# EAGLE design CAN_controller_main_dash (EAGLE 9.6.2)
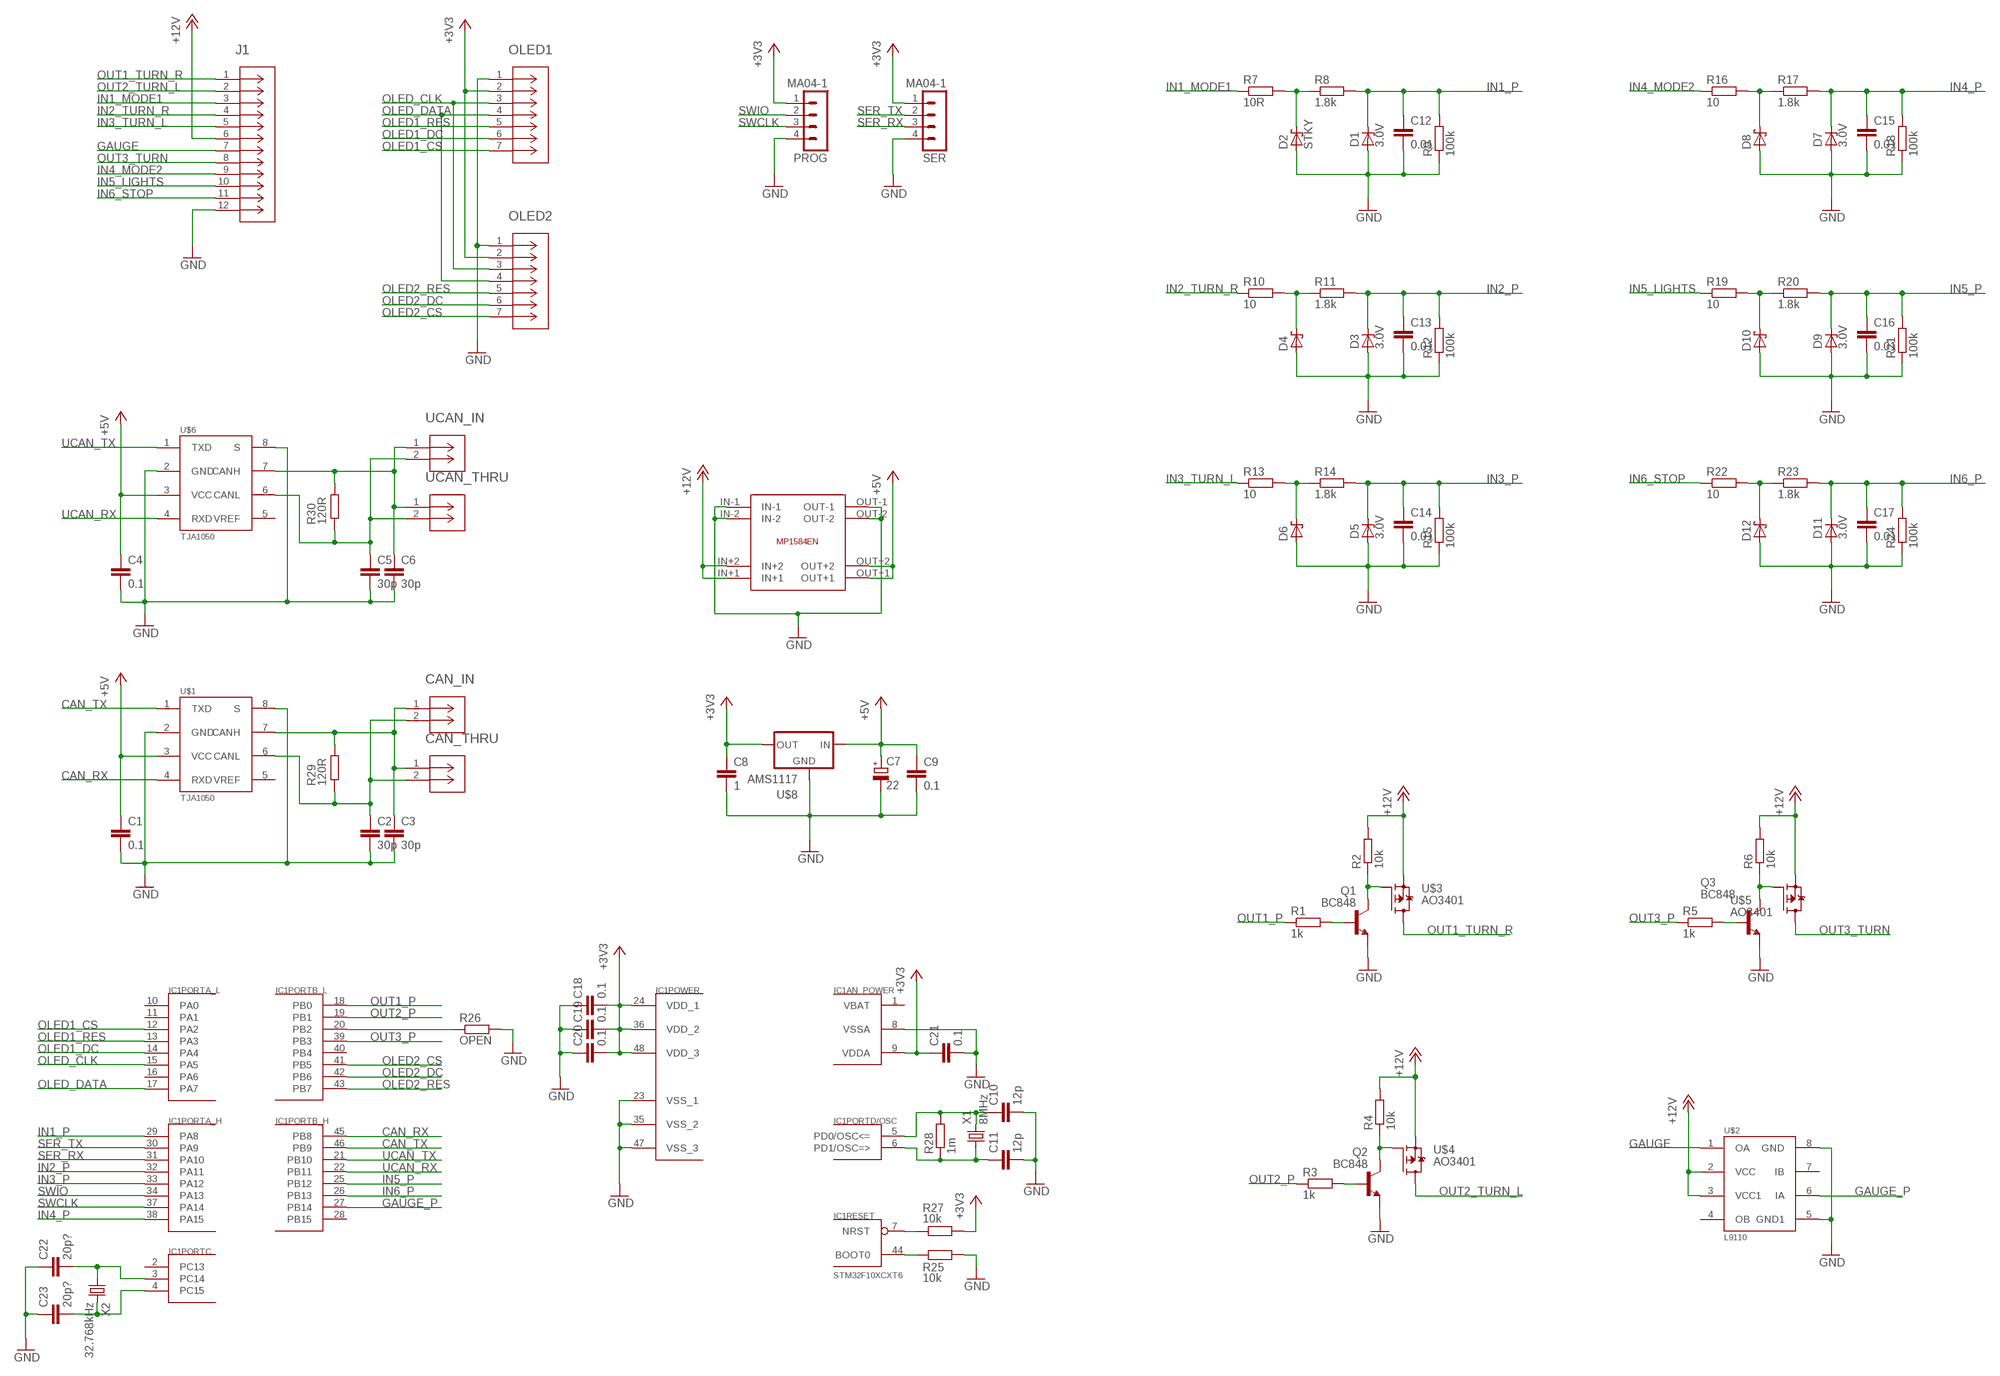
[diagram p0: schematic, sheet 1]

## Parts
C1  0.1  C-EUC0603  [C0603]
C2  30p  C-EUC0603  [C0603]
C3  30p  C-EUC0603  [C0603]
C4  0.1  C-EUC0603  [C0603]
C5  30p  C-EUC0603  [C0603]
C6  30p  C-EUC0603  [C0603]
C7  22  CPOL-EUA/3216-18R  [A/3216-18R]
C8  1  C-EUC0805  [C0805]
C9  0.1  C-EUC0603  [C0603]
C10  12p  C-EUC0603  [C0603]
C11  12p  C-EUC0603  [C0603]
C12  0.01  C-EUC0603  [C0603]
C13  0.01  C-EUC0603  [C0603]
C14  0.01  C-EUC0603  [C0603]
C15  0.01  C-EUC0603  [C0603]
C16  0.01  C-EUC0603  [C0603]
C17  0.01  C-EUC0603  [C0603]
C18  0.1  C-EUC0603  [C0603]
C19  0.1  C-EUC0603  [C0603]
C20  0.1  C-EUC0603  [C0603]
C21  0.1  C-EUC0603  [C0603]
C22  20p?  C-EUC0603  [C0603]
C23  20p?  C-EUC0603  [C0603]
CAN_IN  CAN_IN  MOLEX_2068320202  [CON_2068320202_MOL]
CAN_THRU  MOLEX_2068320202  [CON_2068320202_MOL]
D1  3.0V  DIODE_ZENER0603  [ZD0603]
D2  STKY  DIODE_SCHOTTKY  [ZD0603]
D3  3.0V  DIODE_ZENER0603  [ZD0603]
D4  DIODE_SCHOTTKY  [ZD0603]
D5  3.0V  DIODE_ZENER0603  [ZD0603]
D6  DIODE_SCHOTTKY  [ZD0603]
D7  3.0V  DIODE_ZENER0603  [ZD0603]
D8  DIODE_SCHOTTKY  [ZD0603]
D9  3.0V  DIODE_ZENER0603  [ZD0603]
D10  DIODE_SCHOTTKY  [ZD0603]
D11  3.0V  DIODE_ZENER0603  [ZD0603]
D12  DIODE_SCHOTTKY  [ZD0603]
IC1  STM32F10XCXT6  [TQFP48]
J1  MOLEX_2068321202  [CON_2068321202_MOL]
OLED1  MOLEX_1053091107  [CON_1053091107]
OLED2  MOLEX_1053091107  [CON_1053091107]
PROG  MA04-1  [1X04]
Q1  BC848  BC848ALT1SMD  [SOT23]
Q2  BC848  BC848ALT1SMD  [SOT23]
Q3  BC848  BC848ALT1SMD  [SOT23]
R1  1k  R-EU_R0603  [R0603]
R2  10k  R-EU_R0603  [R0603]
R3  1k  R-EU_R0603  [R0603]
R4  10k  R-EU_R0603  [R0603]
R5  1k  R-EU_R0603  [R0603]
R6  10k  R-EU_R0603  [R0603]
R7  10R  R-EU_R0603  [R0603]
R8  1.8k  R-EU_R0603  [R0603]
R9  100k  R-EU_R0603  [R0603]
R10  10  R-EU_R0603  [R0603]
R11  1.8k  R-EU_R0603  [R0603]
R12  100k  R-EU_R0603  [R0603]
R13  10  R-EU_R0603  [R0603]
R14  1.8k  R-EU_R0603  [R0603]
R15  100k  R-EU_R0603  [R0603]
R16  10  R-EU_R0603  [R0603]
R17  1.8k  R-EU_R0603  [R0603]
R18  100k  R-EU_R0603  [R0603]
R19  10  R-EU_R0603  [R0603]
R20  1.8k  R-EU_R0603  [R0603]
R21  100k  R-EU_R0603  [R0603]
R22  10  R-EU_R0603  [R0603]
R23  1.8k  R-EU_R0603  [R0603]
R24  100k  R-EU_R0603  [R0603]
R25  10k  R-EU_R0603  [R0603]
R26  OPEN  R-EU_R0603  [R0603]
R27  10k  R-EU_R0603  [R0603]
R28  1m  R-EU_R0603  [R0603]
R29  120R  R-EU_R0603  [R0603]
R30  120R  R-EU_R0603  [R0603]
SER  MA04-1  [1X04]
U$1  TJA1050  [SO08]
U$2  L9110  [SO08]
U$3  AO3401  [SOT23]
U$4  AO3401  [SOT23]
U$5  AO3401  [SOT23]
U$6  TJA1050  [SO08]
U$7  MP1584_DC-DC_MODULEMINI_22X17  [MP1584_DC-DC_MODULE]
U$8  AMS1117  [SOT223-W]
UCAN_IN  MOLEX_2068320202  [CON_2068320202_MOL]
UCAN_THRU  MOLEX_2068320202  [CON_2068320202_MOL]
X1  8MHz  CRYSTAL  [XTAL-ECX-53]
X2  32.768kHz  CRYSTALMM20SS  [MM20SS]

## Nets
+3V3: C8.1 C18.2 C19.2 C20.2 C21.1 IC1.9(AN_POWER:VDDA) IC1.24(POWER:VDD_1) IC1.36(POWER:VDD_2) IC1.48(POWER:VDD_3) OLED1.2 OLED2.2 PROG.1 R27.2 SER.1 U$8.2(OUT)
+5V: C1.1 C4.1 C7.+ C9.1 U$1.3(VCC) U$6.3(VCC) U$7.OUT+1 U$7.OUT+2 U$8.3(IN)
+12V: J1.6 R2.2 R4.2 R6.2 U$2.2(VCC) U$2.3(VCC1) U$3.2(S) U$4.2(S) U$5.2(S) U$7.IN+1 U$7.IN+2
CAN_RX: IC1.45(PORTB_H:PB8) U$1.4(RXD)
CAN_TX: IC1.46(PORTB_H:PB9) U$1.1(TXD)
CANH: C3.1 CAN_IN.1 CAN_THRU.1 R29.2 U$1.7(CANH)
CANL: C2.1 CAN_IN.2 CAN_THRU.2 R29.1 U$1.6(CANL)
GAUGE: J1.7 U$2.1(OA)
GAUGE_P: IC1.27(PORTB_H:PB14) U$2.6(IA)
GND: C1.2 C2.2 C3.2 C4.2 C5.2 C6.2 C7.- C8.2 C9.2 C10.2 C11.2 C12.2 C13.2 C14.2 C15.2 C16.2 C17.2 C18.1 C19.1 C20.1 C21.2 C22.1 C23.1 D1.A D2.A D3.A D4.A D5.A D6.A D7.A D8.A D9.A D10.A D11.A D12.A IC1.8(AN_POWER:VSSA) IC1.23(POWER:VSS_1) IC1.35(POWER:VSS_2) IC1.47(POWER:VSS_3) J1.12 OLED1.1 OLED2.1 PROG.4 Q1.2(E) Q2.2(E) Q3.2(E) R9.1 R12.1 R15.1 R18.1 R21.1 R24.1 R25.2 R26.2 SER.4 U$1.2(GND) U$1.8(S) U$2.5(GND1) U$2.8(GND) U$6.2(GND) U$6.8(S) U$7.IN-1 U$7.IN-2 U$7.OUT-1 U$7.OUT-2 U$8.1(GND)
IN1_MODE1: J1.3 R7.1
IN1_P: C12.1 D1.C IC1.29(PORTA_H:PA8) R8.2 R9.2
IN2_P: C13.1 D3.C IC1.32(PORTA_H:PA11) R11.2 R12.2
IN2_TURN_R: J1.4 R10.1
IN3_P: C14.1 D5.C IC1.33(PORTA_H:PA12) R14.2 R15.2
IN3_TURN_L: J1.5 R13.1
IN4_MODE2: J1.9 R16.1
IN4_P: C15.1 D7.C IC1.38(PORTA_H:PA15) R17.2 R18.2
IN5_LIGHTS: J1.10 R19.1
IN5_P: C16.1 D9.C IC1.25(PORTB_H:PB12) R20.2 R21.2
IN6_P: C17.1 D11.C IC1.26(PORTB_H:PB13) R23.2 R24.2
IN6_STOP: J1.11 R22.1
N$1: Q2.1(B) R3.2
N$2: Q2.3(C) R4.1 U$4.1(G)
N$5: Q3.1(B) R5.2
N$6: Q1.1(B) R1.2
N$7: Q1.3(C) R2.1 U$3.1(G)
N$8: Q3.3(C) R6.1 U$5.1(G)
N$11: C10.1 IC1.5(PORTD/OSC:PD0/OSC<=) R28.2 X1.2
N$12: C11.1 IC1.6(PORTD/OSC:PD1/OSC=>) R28.1 X1.1
N$13: D2.C R7.2 R8.1
N$14: IC1.44(RESET:BOOT0) R25.1
N$15: D4.C R10.2 R11.1
N$16: IC1.20(PORTB_L:PB2) R26.1
N$18: IC1.7(RESET:NRST) R27.1
N$19: D6.C R13.2 R14.1
N$20: C22.2 IC1.3(PORTC:PC14) X2.1
N$21: C23.2 IC1.4(PORTC:PC15) X2.4
N$22: D8.C R16.2 R17.1
N$25: D10.C R19.2 R20.1
N$28: D12.C R22.2 R23.1
OLED1_CS: IC1.12(PORTA_L:PA2) OLED1.7
OLED1_DC: IC1.14(PORTA_L:PA4) OLED1.6
OLED1_RES: IC1.13(PORTA_L:PA3) OLED1.5
OLED2_CS: IC1.41(PORTB_L:PB5) OLED2.7
OLED2_DC: IC1.42(PORTB_L:PB6) OLED2.6
OLED2_RES: IC1.43(PORTB_L:PB7) OLED2.5
OLED_CLK: IC1.15(PORTA_L:PA5) OLED1.3 OLED2.3
OLED_DATA: IC1.17(PORTA_L:PA7) OLED1.4 OLED2.4
OUT1_P: IC1.18(PORTB_L:PB0) R1.1
OUT1_TURN_R: J1.1 U$3.3(D)
OUT2_P: IC1.19(PORTB_L:PB1) R3.1
OUT2_TURN_L: J1.2 U$4.3(D)
OUT3_P: IC1.39(PORTB_L:PB3) R5.1
OUT3_TURN: J1.8 U$5.3(D)
SER_RX: IC1.31(PORTA_H:PA10) SER.3
SER_TX: IC1.30(PORTA_H:PA9) SER.2
SWCLK: IC1.37(PORTA_H:PA14) PROG.3
SWIO: IC1.34(PORTA_H:PA13) PROG.2
UCAN_RX: IC1.22(PORTB_H:PB11) U$6.4(RXD)
UCAN_TX: IC1.21(PORTB_H:PB10) U$6.1(TXD)
UCANH: C6.1 R30.2 U$6.7(CANH) UCAN_IN.1 UCAN_THRU.1
UCANL: C5.1 R30.1 U$6.6(CANL) UCAN_IN.2 UCAN_THRU.2
Unconnected: IC1.2(PORTC:PC13) IC1.10(PORTA_L:PA0) IC1.11(PORTA_L:PA1) IC1.16(PORTA_L:PA6) IC1.28(PORTB_H:PB15) IC1.40(PORTB_L:PB4) U$1.5(VREF) U$2.4(OB) U$2.7(IB) U$6.5(VREF)

## Power pins joined to a net without a drawn wire
VBAT: IC1.1(AN_POWER:VBAT)

## Library data of the parts
C1-C6 C8-C23 = rcl:C-EU: CAPACITOR, European symbol; SPICEPREFIX: C
C7 = rcl:CPOL-EU: POLARIZED CAPACITOR, European symbol; SPICEPREFIX: C
CAN_IN CAN_THRU UCAN_IN UCAN_THRU = Molex_UL:MOLEX_2068320202; COPYRIGHT: Copyright (C) 2022 Ultra Librarian. All rights reserved.; MANUFACTURER_PART_NUMBER: 2068320202; MFR_NAME: Molex Connector Corporation
D1 D3 D5 D7 D9 D11 = common_components:DIODE_ZENER: Z DIODE 3.3 V, 1W, 5 percent
D2 D4 D6 D8 D10 D12 = common_components:DIODE_SCHOTTKY: Schottky Diode
IC1 = stm32:STM32F10XCXT6: ST STM32F101/103 48pin LQFP
J1 = Molex_UL:MOLEX_2068321202; COPYRIGHT: Copyright (C) 2022 Ultra Librarian. All rights reserved.; MANUFACTURER_PART_NUMBER: 2068321202; MFR_NAME: Molex Connector Corporation
OLED1 OLED2 = Molex_UL:MOLEX_1053091107; COPYRIGHT: Copyright (C) 2022 Ultra Librarian. All rights reserved.; MANUFACTURER_PART_NUMBER: 1053091107; MFR_NAME: Molex Connector Corporation
PROG SER = motorcycle_projects:MA04-1
Q1-Q3 = common_components:BC848*: NPN Transistor
R1-R6 R25-R30 = resistor:R-EU_: RESISTOR, European symbol
R7-R24 = rcl:R-EU_: RESISTOR, European symbol; SPICEPREFIX: R
U$1 U$6 = motorcycle_projects_copy:TJA1050
U$2 = motorcycle_projects_copy:L9110
U$3-U$5 = common_components:AO3401: 30V 4A P-Channel MOSFET Datasheet: http://www.aosmd.com/pdfs/datasheet/AO3401.pdf
U$7 = common_components:MP1584_DC-DC_MODULE
U$8 = motorcycle_projects_copy:AMS1117
X1 X2 = common_components:CRYSTAL: CRYSTAL

## Board
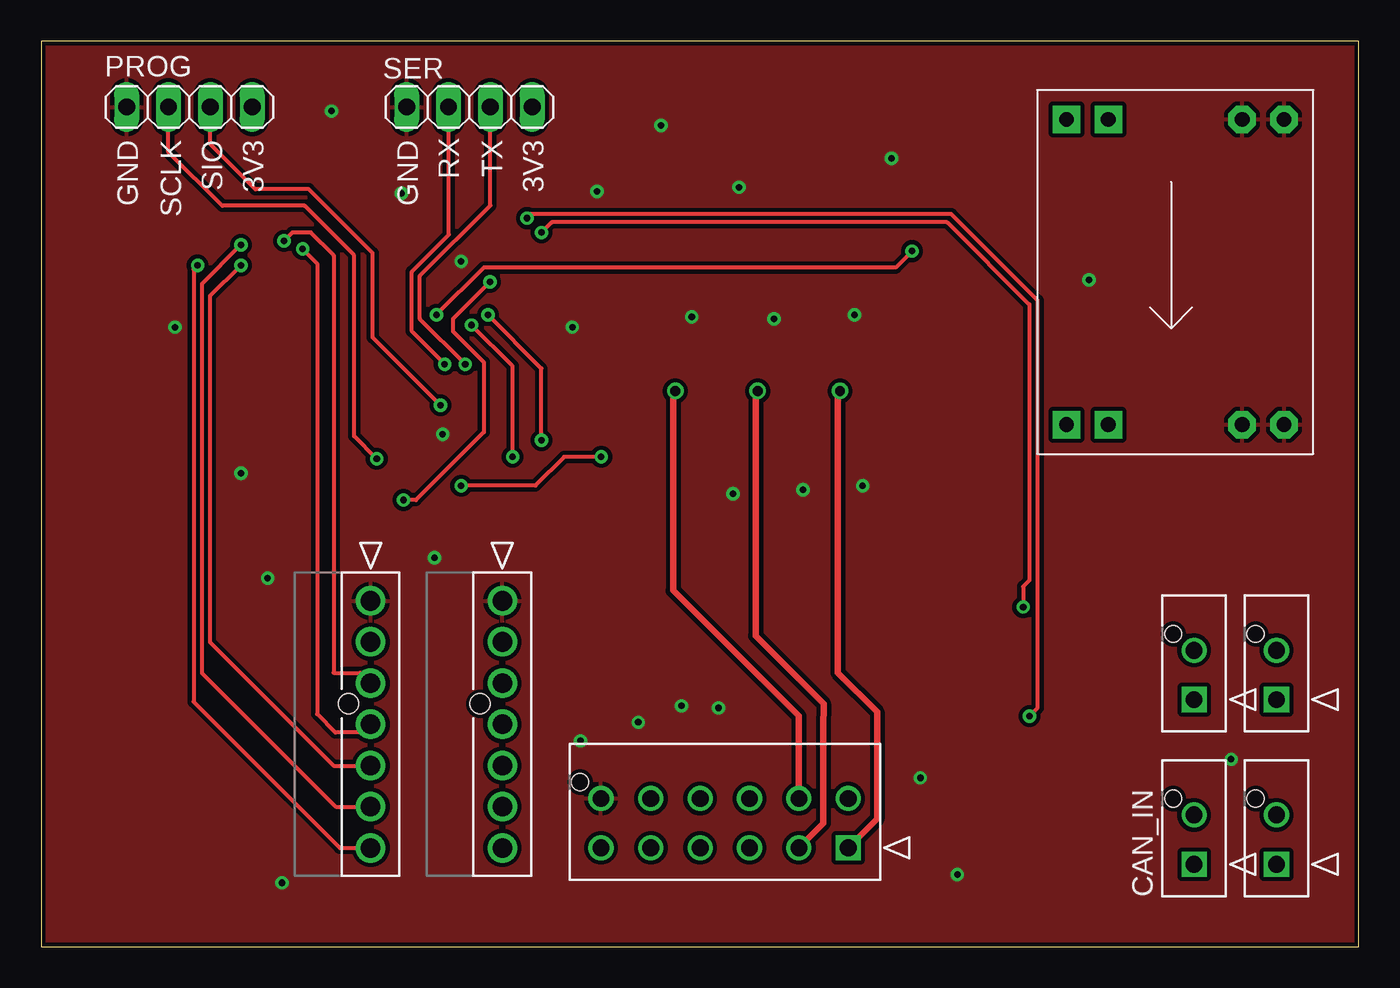
[diagram p1: board, top side]
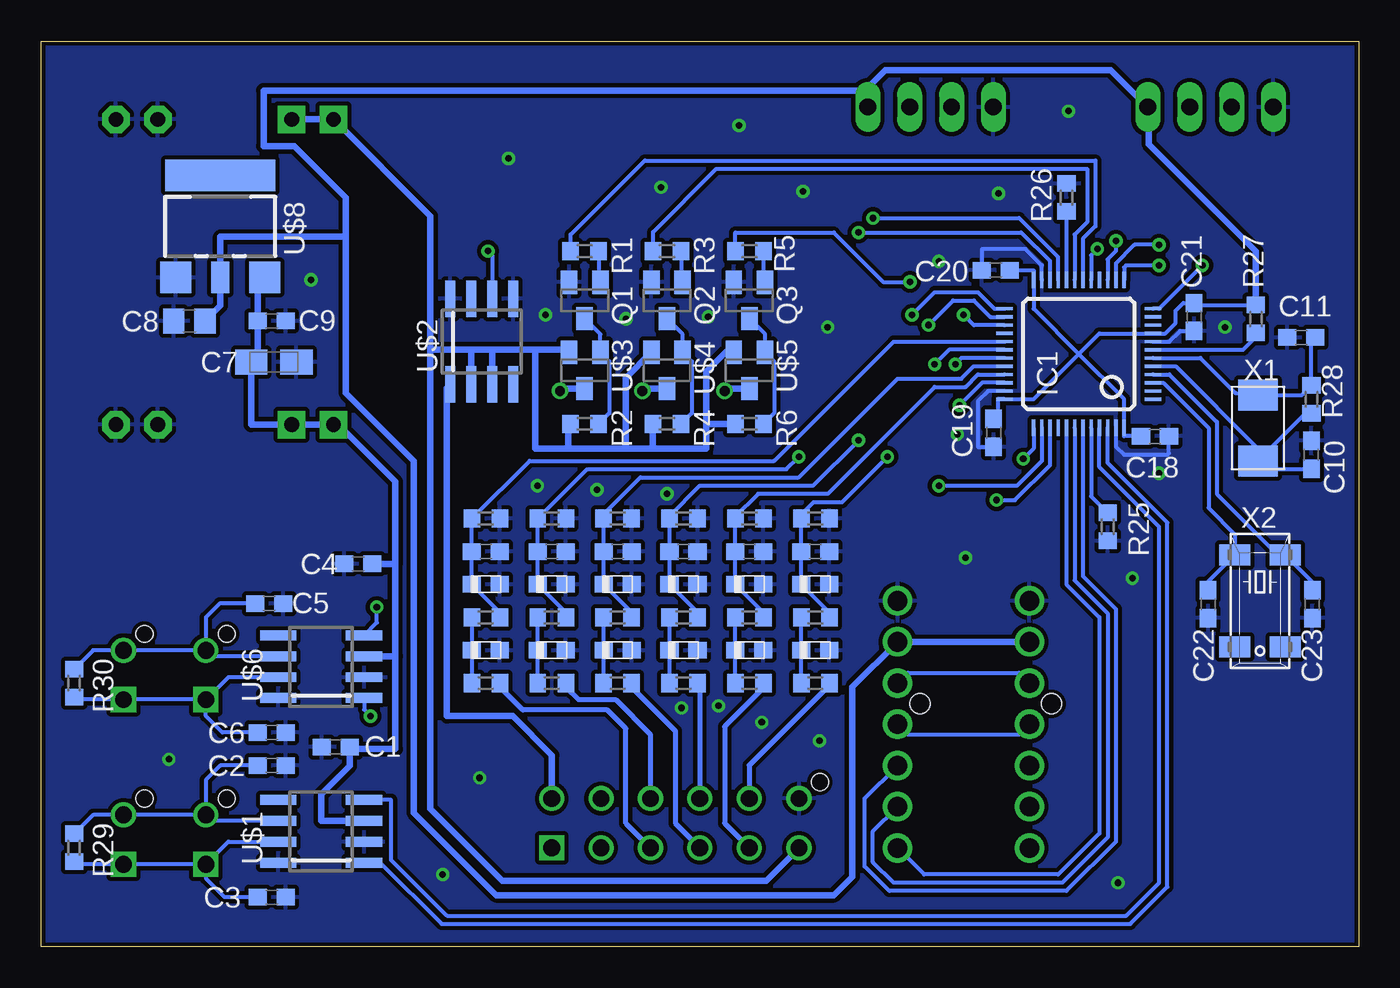
[diagram p2: board, bottom side, seen from below]

Size 80 x 55 mm. Coordinates in mm from the lower left corner, seen from the top.
Outline: 0,0 80,0 80,55 0,55 0,0
Copper layers (1*16): Top 0.035mm / dielectric 1.5mm / Bottom 0.035mm
Design rules "default *": minimum track width 0.2mm, minimum drill 0.35mm, track to track 0.24mm, track to pad 0.24mm, pad to pad 0.24mm, via to via 0.24mm, smd to smd 0.24mm, copper to edge 0.25mm, drill to drill 6mil, minimum pad ring 10mil, minimum via ring 8mil, stop-mask expansion 4mil, vias tented up to drill 0mil, thermal gap 10mil

### Footprints (pad centres in the part's own frame; a part is rotated, then mirrored left to right if it is on the bottom)
C0603 = smd 1.1 x 1: 1 -0.85,0; 2 0.85,0
A/3216-18R = smd 1.95 x 1.5: + 1.375,0; - -1.375,0
C0805 = smd 1.3 x 1.5: 1 -0.95,0; 2 0.95,0
CON_2068320202_MOL = drill 1.016 pad 1.524 square: 1 0,0 | drill 1.016 pad 1.524: 2 0,2.997 | hole 1.016: -1.27,3.99
ZD0603 = smd 1.1 x 1: A -0.85,0; C 0.85,0
TQFP48 = smd 0.2 x 1: 1 -2.75,-4.5; 2 -2.25,-4.5; 3 -1.75,-4.5; 4 -1.25,-4.5; 5 -0.75,-4.5; 6 -0.25,-4.5; 7 0.25,-4.5; 8 0.75,-4.5; 9 1.25,-4.5; 10 1.75,-4.5; 11 2.25,-4.5; 12 2.75,-4.5; 25 2.75,4.5; 26 2.25,4.5; 27 1.75,4.5; 28 1.25,4.5; 29 0.75,4.5; 30 0.25,4.5; 31 -0.25,4.5; 32 -0.75,4.5; 33 -1.25,4.5; 34 -1.75,4.5; 35 -2.25,4.5; 36 -2.75,4.5 | smd 1 x 0.2: 13 4.5,-2.75; 14 4.5,-2.25; 15 4.5,-1.75; 16 4.5,-1.25; 17 4.5,-0.75; 18 4.5,-0.25; 19 4.5,0.25; 20 4.5,0.75; 21 4.5,1.25; 22 4.5,1.75; 23 4.5,2.25; 24 4.5,2.75; 37 -4.5,2.75; 38 -4.5,2.25; 39 -4.5,1.75; 40 -4.5,1.25; 41 -4.5,0.75; 42 -4.5,0.25; 43 -4.5,-0.25; 44 -4.5,-0.75; 45 -4.5,-1.25; 46 -4.5,-1.75; 47 -4.5,-2.25; 48 -4.5,-2.75
CON_2068321202_MOL = drill 1.016 pad 1.524 square: 1 0,0 | drill 1.016 pad 1.524: 2 -2.997,0; 3 -5.994,0; 4 -8.992,0; 5 -11.989,0; 6 -15.011,0; 7 0,2.997; 8 -2.997,2.997; 9 -5.994,2.997; 10 -8.992,2.997; 11 -11.989,2.997; 12 -15.011,2.997 | hole 1.016: -16.275,3.99
CON_1053091107 = drill 1.194 pad 1.702: 1 0,0; 2 2.489,0; 3 5.004,0; 4 7.493,0; 5 10.008,0; 6 12.497,0; 7 15.011,0 | hole 1.2: 6.25,-1.35
1X04 = drill 1.016 long: 1 -3.81,0; 2 -1.27,0; 3 1.27,0; 4 3.81,0
SOT23 = smd 1 x 1.4: 1 -0.95,-1.1; 2 0.95,-1.1; 3 0,1.1
R0603 = smd 1 x 1.1: 1 -0.85,0; 2 0.85,0
SO08 = smd 0.6 x 2.2: 1 -1.905,-2.6; 2 -0.635,-2.6; 3 0.635,-2.6; 4 1.905,-2.6; 5 1.905,2.6; 6 0.635,2.6; 7 -0.635,2.6; 8 -1.905,2.6
MP1584_DC-DC_MODULE = drill 0.9 pad 1.676 square: IN+1 0,0; IN+2 0,2.54; OUT+1 18.542,0; OUT+2 18.542,2.54 | drill 0.9 pad 1.676 octagon: IN-1 0,13.208; IN-2 0,10.668; OUT-1 18.542,13.208; OUT-2 18.542,10.668
SOT223-W = smd 1.9 x 1.9: 1 -2.7,-3.1; 3 2.7,-3.1 | smd 1.1 x 1.9: 2 0,-3.1 | smd 6.7 x 1.9: 4 0,3.1
XTAL-ECX-53 = smd 1.9 x 2.4: 1 -2,0; 2 2,0
MM20SS = smd 1.27 x 1.88: 1 -2.794,-1.524; 2 2.794,-1.524; 3 2.794,1.524; 4 -2.794,1.524

### Placement (x,y rotation side)
C1  62.12,12.12 180 bottom
C2  66,11 0 bottom
C3  66,3 0 bottom
C4  60.75,23.25 180 bottom
C5  66.15,20.84 0 bottom
C6  66,13 0 bottom
C7  65.88,35.5 180 bottom
C8  71,38 180 bottom
C9  66,38 0 bottom
C10  2.88,29.88 90 bottom
C11  3.5,37 180 bottom
C12  53,24 0 bottom
C13  45,24 0 bottom
C14  37,24 0 bottom
C15  49,24 0 bottom
C16  41,24 0 bottom
C17  33,24 0 bottom
C18  12.38,31 180 bottom
C19  22.17,31.21 90 bottom
C20  22.04,41.09 0 bottom
C21  10,38.25 270 bottom
C22  9.15,20.8 90 bottom
C23  2.82,20.8 90 bottom
CAN_IN  70,5 0 top
CAN_THRU  75,5 0 top
D1  53,22 180 bottom
D2  53,18 180 bottom
D3  45,22 180 bottom
D4  45,18 180 bottom
D5  37,22 180 bottom
D6  37,18 180 bottom
D7  49,22 180 bottom
D8  49,18 180 bottom
D9  41,22 180 bottom
D10  41,18 180 bottom
D11  33,22 180 bottom
D12  33,18 180 bottom
IC1  17,36 90 bottom
J1  49,6 0 top
OLED1  20,21 270 top
OLED2  28,21 270 top
PROG  9,51 180 top
Q1  47,39.25 180 bottom
Q2  42,39.25 180 bottom
Q3  37,39.25 180 bottom
R1  47,42.25 0 bottom
R2  47,31.75 180 bottom
R3  42,42.25 0 bottom
R4  42,31.75 180 bottom
R5  37,42.25 0 bottom
R6  37,31.75 180 bottom
R7  53,16 180 bottom
R8  53,20 0 bottom
R9  53,26 180 bottom
R10  45,16 180 bottom
R11  45,20 0 bottom
R12  45,26 180 bottom
R13  37,16 180 bottom
R14  37,20 0 bottom
R15  37,26 180 bottom
R16  49,16 180 bottom
R17  49,20 0 bottom
R18  49,26 180 bottom
R19  41,16 180 bottom
R20  41,20 0 bottom
R21  41,26 180 bottom
R22  33,16 180 bottom
R23  33,20 0 bottom
R24  33,26 180 bottom
R25  15.25,25.5 270 bottom
R26  17.75,45.5 90 bottom
R27  6.25,38.12 90 bottom
R28  2.88,33.25 270 bottom
R29  78,6 270 bottom
R30  78,16 270 bottom
SER  26,51 180 top
U$1  63,7 90 bottom
U$2  53.25,36.75 0 bottom
U$3  47,35 180 bottom
U$4  42,35 180 bottom
U$5  37,35 180 bottom
U$6  63,17 90 bottom
U$7  62.25,50.25 270 top
U$8  69.12,43.75 0 bottom
UCAN_IN  70,15 0 top
UCAN_THRU  75,15 0 top
X1  6.12,31.5 270 bottom
X2  6,21 270 bottom

### Tracks (layer width: path | path; a pad name or v marks a point on that pad's centre or on a via)
+3V3
  Bottom 0.254: C20.2 19.75,41.09 IC1.24 19.75,38.75 17,36 | C19.2 21.92,32.31 21.92,33.25 IC1.36 19.75,33.25 17,36 | C18.2 14.25,31 IC1.48 14.25,33.25 17,36 | 17,36 15.75,37.25 IC1.9 11.75,37.25 11.12,37.88 11.12,38.62 10.65,39.1 C21.1 9.88,38.98 R27.2
  Bottom 0.406: OLED1.2 OLED2.2 30.75,15.76 30.75,4.25 31.88,3.12 52.38,3.12 57.38,8.12 57.38,29.5 61.5,33.62 61.5,43.12 | C8.1 69.12,38.92 U$8.2 69.12,43.12 61.5,43.12 | 30,52 29.81,52 SER.1 | 30,52 66.5,52 66.5,48.62 64.62,48.62 61.5,45.5 61.5,43.12 | 30,52 28.75,53.25 15.06,53.25 PROG.1 12.75,50.94 12.75,48.75 6.25,42.25 R27.2
+5V
  Bottom 0.406: U$8.3 66.85,40.23 C9.1 66.85,35.9 C7.+ 67.25,31.71 U$7.OUT+2 U$7.OUT+1 61.96,31.71 58.5,28.25 58.5,23.25 | U$6.3 58.5,17.64 | 58.5,17.64 58.5,12 61.15,12 C1.1 61.27,10.97 63,9.25 63,8 63,7.63 U$1.3 | C4.1 58.5,23.25 | 58.5,17.64 58.5,23.25
+12V
  Bottom 0.406: U$3.2 48.1,36.25 50,36.25 | 50,36.25 52.62,36.25 | U$2.2 53.88,36.25 | 53.88,36.25 56.38,36.25 | 56.38,36.25 56.38,44 56.38,44.27 56.38,44.38 U$7.IN+1 U$7.IN+2 | U$2.3 52.62,36.25 | U$5.2 38.45,36.1 39.62,34.92 39.62,31.75 | 39.62,31.75 39.62,30.25 42.88,30.25 | 42.88,30.25 42.88,31.73 R4.2 | U$4.2 44.5,34.55 44.5,30.25 | 52.62,36.25 53.88,36.25 | 44.5,30.25 48,30.25 | 48,30.25 48,31.75 R2.2 | 42.88,30.25 44.5,30.25 | 48,30.25 50,30.25 50,36.25 | J1.6 35.99,4 52,4 56.38,8.38 56.38,36.25 | R6.2 39.62,31.75
CAN_RX
  Bottom 0.254: IC1.45 15.75,29.12 12.12,25.5 12.12,3.88 14.12,1.88 55.38,1.88 58.75,5.25 58.75,8.9 U$1.4
CAN_TX
  Bottom 0.254: U$1.1 59.4,5.09 55.68,1.38 13.88,1.38 11.62,3.62 11.62,25.75 15.25,29.38 IC1.46
CANH
  Bottom 0.254: CAN_IN.1 CAN_THRU.1 77.85,5 R29.2 | U$1.7 68.64,6.37 CAN_IN.1 | CAN_IN.1 70,4.15 68.85,3 C3.1
CANL
  Bottom 0.254: U$1.6 69.64,7.63 CAN_IN.2 | CAN_IN.2 CAN_THRU.2 76.85,8 R29.1 | C2.1 69.12,11 70,10.12 CAN_IN.2
GAUGE
  Bottom 0.406: J1.7 49,11.62 51.38,14 55.38,14 55.38,33.93 U$2.1
GAUGE_P  (via drill 0.4)
  Top 0.254: v24,38.38 26.88,41.25 51.88,41.25 v52.88,42.25
  Bottom 0.254: v24,38.38 23.38,37.75 IC1.27 | v52.88,42.25 52.62,41.99 U$2.6
GND  (via drill 0.4)
  Bottom 0.254: IC1.23 19.25,41.38 20.25,42.38 22.86,42.38 22.89,42.34 C20.1 | IC1.35 22.5,33.75 23.12,33.12 23.12,30.36 C19.1 | IC1.47 14.75,30.38 14.25,29.88 11.62,29.88 11.53,29.98 C18.1 | IC1.8 11.5,36.75 10.85,37.4 C21.2
  other vias: 49.88,28 46.25,27.75 42,27.5 41.12,14.5 38.88,14.62 36.25,13.62 13.75,22.38 14.62,3.88 12.12,28.75 25.5,41.62 24.38,31.12 8.12,37.62 23.88,23.62 53.38,10.25 32.75,12.5 17.62,50.75 37.62,49.88 51.62,47.88 63.62,40.5 32.25,37.62 55.62,4.38 72.25,11.38 33.75,45.88 42.38,46.12 21.88,45.75 39.5,38.25 44.5,38.12 49.38,38.38
  pour Bottom (isolate 0.254): 0,0 80,0 80,55 0,55
  pour Top (isolate 0.254): 0,0 80,0 80,55 0,55
IN1_MODE1
  Bottom 0.254: 52.15,15.78 R7.1
  Bottom 0.305: J1.3 44.5,7.49 44.5,13.25 45.62,14.38 50.75,14.38 52.15,15.78
IN1_P
  Bottom 0.254: R8.2 52.15,20.3 D1.C C12.1 R9.2 50.35,29.5 35.5,29.5 28.25,36.75 IC1.29
IN2_P
  Bottom 0.254: R11.2 44.15,20.3 D3.C C13.1 R12.2 45.85,26.27 43.62,28.5 34,28.5 28,34.5 24.12,34.5 23.38,35.25 IC1.32
IN2_TURN_R
  Bottom 0.254: R10.1 44.15,15.75
  Bottom 0.305: 44.15,15.75 41.5,13.1 41.5,7.49 J1.4
IN3_P
  Bottom 0.254: R14.2 36.15,20.3 D5.C C14.1 R15.2 37.85,26.12 36.48,27.5 32.25,27.5 25.75,34 23.88,34 23.12,34.75 IC1.33
IN3_TURN_L
  Bottom 0.254: R13.1 36.15,15.72
  Bottom 0.305: 36.15,15.72 38.5,13.38 38.5,7.49 J1.5
IN4_MODE2
  Bottom 0.254: R16.1 48.15,15.78
  Bottom 0.305: 48.15,15.78 47.38,15 45.12,15 43.01,12.88 J1.9
IN4_P  (via drill 0.4)
  Top 0.254: v34,29.75 31.75,29.75 30,28 v25.5,28
  Bottom 0.254: R17.2 48.15,20.3 D7.C C15.1 R18.2 46.85,29 34.75,29 v34,29.75 | v25.5,28 20.75,28 19.25,29.5 IC1.38
IN5_LIGHTS
  Bottom 0.254: R19.1 40.15,15.78 40.01,15.63
  Bottom 0.305: 40.01,15.63 J1.10
IN5_P  (via drill 0.4)
  Top 0.254: v30.38,30.75 30.38,35.12 v27.12,38.38
  Bottom 0.254: R20.2 40.15,20.3 D9.C C16.1 R21.2 41.85,26.15 40,28 33.12,28 v30.38,30.75 | v27.12,38.38 25.75,39.75 23.12,39.75 22.12,38.75 IC1.25
IN6_P  (via drill 0.4)
  Top 0.254: v28.62,29.75 28.62,35.25 v26.12,37.75
  Bottom 0.254: R23.2 32.15,20.3 D11.C C17.1 R24.2 33.85,26.25 33.1,27 31.38,27 v28.62,29.75 | v26.12,37.75 24.62,39.25 23.38,39.25 22.38,38.25 IC1.26
IN6_STOP
  Bottom 0.254: R22.1 32.15,15.88
  Bottom 0.305: 32.15,15.88 37.01,11.01 J1.11
N$1
  Bottom 0.254: R3.2 41.15,40.45 Q2.1
N$2
  Bottom 0.254: Q2.3 41.05,37.2 U$4.1 40.5,35.55 40.5,32.4 R4.1
N$5
  Bottom 0.254: R5.2 36.15,40.45 Q3.1
N$6
  Bottom 0.254: R1.2 46.15,40.45 Q1.1
N$7
  Bottom 0.254: Q1.3 46.05,37.2 U$3.1 45.5,35.55 45.5,32.4 R2.1
N$8
  Bottom 0.254: Q3.3 36.05,37.2 U$5.1 35.5,35.55 35.5,32.4 R6.1
N$11
  Bottom 0.254: IC1.5 11.12,35.25 6.12,30.25 X1.2 | X1.2 5.65,29.02 C10.1 | X1.2 3.23,32.4 R28.2
N$12
  Bottom 0.254: C11.1 2.88,37 R28.1 3.48,33.5 X1.1 7.5,33.62 9.62,35.75 IC1.6
N$13
  Bottom 0.254: R8.1 D2.C R7.2
N$14
  Bottom 0.254: R25.1 16.25,27.35 IC1.44
N$15
  Bottom 0.254: R10.2 D4.C R11.1
N$16
  Bottom 0.254: R26.1 IC1.20
N$18
  Bottom 0.254: IC1.7 7.03,36.25 6.25,37.02 R27.1
N$19
  Bottom 0.254: R13.2 D6.C R14.1
N$20
  Bottom 0.254: IC1.3 11.88,34.25 9.12,31.5 9.12,26.64 7.52,25.04 X2.1 9.15,22.17 C22.2
N$21
  Bottom 0.254: IC1.4 11.5,34.75 8.62,31.88 8.62,27.5 4.92,23.79 X2.4 2.82,22.14 C23.2
N$22
  Bottom 0.254: R16.2 D8.C R17.1
N$25
  Bottom 0.254: R19.2 D10.C R20.1
N$28
  Bottom 0.254: R22.2 D12.C R23.1
OLED1_CS  (via drill 0.4)
  Top 0.254: v9.5,41.38 9.25,41.12 9.25,14.88 18.14,5.99 OLED1.7
  Bottom 0.254: v9.5,41.38 12.12,38.75 IC1.12
OLED1_DC  (via drill 0.4)
  Top 0.254: v12.12,42.62 9.75,40.25 9.75,16.62 17.87,8.5 OLED1.6
  Bottom 0.254: v12.12,42.62 13.62,42.62 14.75,41.5 IC1.14
OLED1_RES  (via drill 0.4)
  Top 0.254: v12.12,41.38 10.25,39.5 10.25,18.5 17.76,10.99 OLED1.5
  Bottom 0.254: v12.12,41.38 14.12,41.38 14.25,41.25 IC1.13
OLED2_CS
  Bottom 0.254: IC1.41 17.75,22 15.75,20 15.75,6.88 18.25,4.38 26.39,4.38 OLED2.7
OLED2_DC
  Bottom 0.254: IC1.42 17.25,22.25 15.25,20.25 15.25,6.62 18,3.88 28.25,3.88 29.5,5.12 29.5,7 OLED2.6
OLED2_RES
  Bottom 0.254: IC1.43 16.75,22.5 14.75,20.5 14.75,6.38 17.75,3.38 28.5,3.38 30,4.88 30,8.99 OLED2.5
OLED_CLK  (via drill 0.4)
  Top 0.254: v14.75,42.88 15.25,43.38 16.38,43.38 17.75,42 17.75,16.62 19.37,16.62 OLED1.3
  Bottom 0.254: OLED2.3 27.37,16.62 20.63,16.62 OLED1.3 | v14.75,42.88 14.75,42.25 15.25,41.75 IC1.15
OLED_DATA  (via drill 0.4)
  Top 0.254: v15.88,42.38 16.75,41.5 16.75,14.12 17.87,13.01 19.5,13.01 OLED1.4
  Bottom 0.254: OLED2.4 27.38,12.88 20.63,12.88 OLED1.4 | v15.88,42.38 16.25,42 IC1.17
OUT1_P
  Bottom 0.254: R1.1 47.85,43.25 43.35,47.75 16,47.75 16,43.75 16.75,43 IC1.18
OUT1_TURN_R  (via drill 0.6)
  Top 0.406: v48.5,33.75 48.38,33.62 48.38,16.62 50.75,14.25 50.75,7.75 J1.1
  Bottom 0.254: 48.35,33.9 v48.5,33.75
  Bottom 0.406: U$3.3 48.35,33.9
OUT2_P
  Bottom 0.254: R3.1 42.85,43.4 39,47.25 16.5,47.25 16.5,44 17.25,43.25 IC1.19
OUT2_TURN_L  (via drill 0.6)
  Top 0.406: v43.5,33.75 43.38,33.62 43.38,18.88 47.5,14.75 47.5,13.25 47.5,7.49 J1.2
  Bottom 0.406: U$4.3 43.35,33.9 v43.5,33.75
OUT3_P  (via drill 0.4)
  Top 0.254: v27.25,40.38 25,38.12 25,37.38 26.88,35.5 26.88,31.25 22.75,27.12 v22,27.12
  Bottom 0.254: R5.1 37.85,43.38 31.88,43.38 28.88,40.38 v27.25,40.38 | v22,27.12 20.88,27.12 18.75,29.25 IC1.39
OUT3_TURN  (via drill 0.6)
  Top 0.406: v38.5,33.75 38.38,33.62 38.38,21.62 46,14 J1.8
  Bottom 0.406: U$5.3 38.35,33.9 v38.5,33.75
SER_RX  (via drill 0.4)
  Top 0.254: v24.5,35.38 22.5,37.38 22.5,41 24.75,43.25 24.75,50.98 SER.3
  Bottom 0.254: IC1.31 24.12,35.75 v24.5,35.38
SER_TX  (via drill 0.4)
  Top 0.254: v25.75,35.38 23,38.12 23,40.75 27.27,45.02 SER.2
  Bottom 0.254: IC1.30 24.88,36.25 v25.75,35.38
SWCLK  (via drill 0.4)
  Top 0.254: v20.38,29.62 19,31 19,42 16,45 11,45 7.73,48.27 PROG.3
  Bottom 0.254: IC1.37 19.75,30.25 v20.38,29.62
SWIO  (via drill 0.4)
  Top 0.254: v24.25,32.88 20.12,37 20.12,42.12 16.25,46 13,46 10.27,48.73 PROG.2
  Bottom 0.254: IC1.34 22.88,34.25 v24.25,32.88
UCAN_RX  (via drill 0.4)
  Top 0.254: v59.62,20.62 59.62,21.88 60,22.25 60,39 55,44 31,44 v30.38,43.38
  Bottom 0.254: IC1.22 18.75,41.62 20.5,43.38 v30.38,43.38 | U$6.4 59.62,19.68 v59.62,20.62
UCAN_TX  (via drill 0.4)
  Top 0.254: v60,14 60.5,14.5 60.5,39.25 55.25,44.5 29.75,44.5 v29.5,44.25
  Bottom 0.254: IC1.21 18.25,41.88 20.62,44.25 v29.5,44.25 | U$6.1 60.4,14.4 v60,14
UCANH
  Bottom 0.254: UCAN_IN.1 UCAN_THRU.1 77.85,15 R30.2 | C6.1 69,13 70,14 UCAN_IN.1 | U$6.7 68.64,16.36 UCAN_IN.1
UCANL
  Bottom 0.254: UCAN_IN.2 UCAN_THRU.2 76.85,18 R30.1 | C5.1 69.16,20.84 70,20 UCAN_IN.2 | U$6.6 69.64,17.64 UCAN_IN.2

### Text on the board
tNames: GND | SCLK | SIO | 3V3 | GND | RX | TX | 3V3